# EAGLE design Nusbio1.0.WaveShare.I2C.LCD (EAGLE 9.6.2)
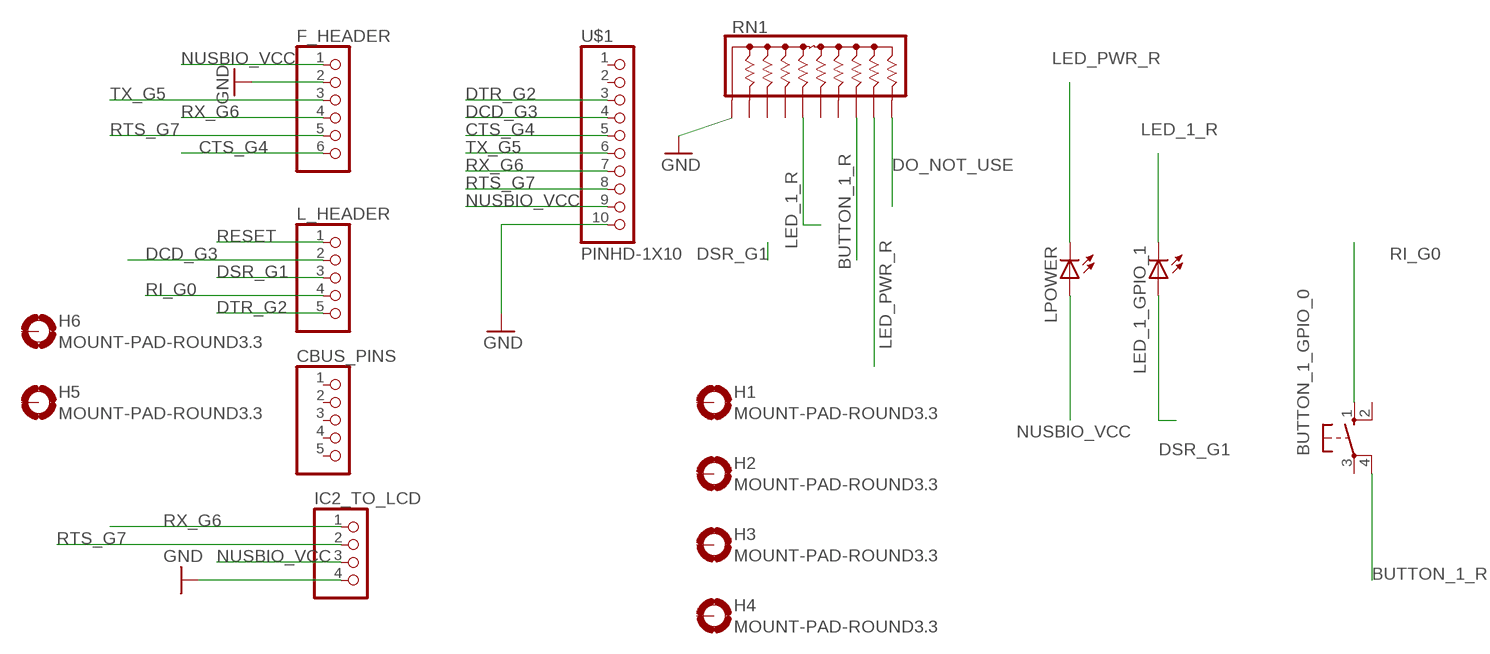
[diagram p0: schematic, sheet 1]

## Parts
BUTTON_1_GPIO_0  10-XX  [B3F-10XX]
CBUS_PINS  PINHD-1X5  [1X05]
F_HEADER  PINHD-1X6  [1X06]
H1  MOUNT-PAD-ROUND3.3  [3,3-PAD]
H2  MOUNT-PAD-ROUND3.3  [3,3-PAD]
H3  MOUNT-PAD-ROUND3.3  [3,3-PAD]
H4  MOUNT-PAD-ROUND3.3  [3,3-PAD]
H5  MOUNT-PAD-ROUND3.3  [3,3-PAD]
H6  MOUNT-PAD-ROUND3.3  [3,3-PAD]
IC2_TO_LCD  PINHD-1X4  [1X04]
L_HEADER  PINHD-1X5  [1X05]
LED_1_GPIO_1  LEDSMT1206  [1206]
LPOWER  LEDSMT1206  [1206]
RN1  4610X  [SIP10]
U$1  PINHD-1X10  [1X10-BIG]

## Nets
BUTTON_1_R: BUTTON_1_GPIO_0.4(P1) RN1.8
CTS_G4: F_HEADER.6 U$1.5
DCD_G3: L_HEADER.2 U$1.4
DO_NOT_USE: RN1.10
DSR_G1: L_HEADER.3 LED_1_GPIO_1.A
DTR_G2: L_HEADER.5 U$1.3
GND: F_HEADER.2 IC2_TO_LCD.4 RN1.1 U$1.10
LED_1_R: LED_1_GPIO_1.C RN1.5
LED_PWR_R: LPOWER.C RN1.9
NUSBIO_VCC: F_HEADER.1 IC2_TO_LCD.3 LPOWER.A U$1.9
RESET: L_HEADER.1
RI_G0: BUTTON_1_GPIO_0.1(S) L_HEADER.4
RTS_G7: F_HEADER.5 IC2_TO_LCD.2 U$1.8
RX_G6: F_HEADER.4 IC2_TO_LCD.1 U$1.7
TX_G5: F_HEADER.3 U$1.6
Unconnected: BUTTON_1_GPIO_0.2(S1) BUTTON_1_GPIO_0.3(P) CBUS_PINS.1 CBUS_PINS.2 CBUS_PINS.3 CBUS_PINS.4 CBUS_PINS.5 H1.B3,3(MOUNT) H2.B3,3(MOUNT) H3.B3,3(MOUNT) H4.B3,3(MOUNT) H5.B3,3(MOUNT) H6.B3,3(MOUNT) RN1.2 RN1.3 RN1.4 RN1.6 RN1.7 U$1.1 U$1.2

## Library data of the parts
BUTTON_1_GPIO_0 = switch-omron:10-XX: OMRON SWITCH; MPN: B3F-1000; OC_FARNELL: 176432; OC_NEWARK: 36M3542
CBUS_PINS L_HEADER = pinhead:PINHD-1X5: PIN HEADER
F_HEADER = adafruit:PINHD-1X6: PIN HEADER
H1-H6 = holes:MOUNT-PAD-ROUND: MOUNTING PAD, round
IC2_TO_LCD = pinhead:PINHD-1X4: PIN HEADER
LED_1_GPIO_1 LPOWER = adafruit:LED: LED OSRAM: - CHIPLED LG R971, LG N971, LY N971, LG Q971, LY Q971, LO R971, LY R971 LH N974, LH R974 LS Q976, LO Q976, LY Q976 LO Q996 - Hyper CHIPLED LW Q18S LB Q993, LB Q99A, LB R99A - SideLED LS A670, LO A670, LY A670, LG A670, LP A670 LB A673, LV A673, LT A673, LW A673 LH A674 LY A675 LS A676, LA A676, LO A676, LY A676, LW A676 LS A679, LY A679, LG A679 - Hyper Micro SIDELED® LS Y876, LA Y876, LO Y876, LY Y876 LT Y87S - SmartLED LW L88C, LW L88S LB L89C, LB L89S, LG L890 LS L89K, LO L89K, LY L89K LS L896, LA L896, LO L896, LY L896 - TOPLED LS T670, LO T670, LY T670, LG T670, LP T670 LSG T670, LSP T670, LSY T670, LOP T670, LYG T670 LG T671, LOG T671, LSG T671 LB T673, LV T673, LT T673, LW T673 LH T674 LS T676, LA T676, LO T676, LY T676, LB T676, LH T676, LSB T676, LW T676 LB T67C, LV T67C, LT T67C, LS T67K, LO T67K, LY T67K, LW E67C LS E67B, LA E67B, LO E67B, LY E67B, LB E67C, LV E67C, LT E67C LW T67C LS T679, LY T679, LG T679 LS T770, LO T770, LY T770, LG T770, LP T770 LB T773, LV T773, LT T773, LW T773 LH T774 LS E675, LA E675, LY E675, LS T675 LS T776, LA T776, LO T776, LY T776, LB T776 LHGB T686 LT T68C, LB T68C - Hyper Mini TOPLED® LB M676 - Mini TOPLED Santana® LG M470 LS M47K, LO M47K, LY M47K Source: http://www.osram.convergy.de/
RN1 = resistor-sip:4610X: Bourns 4600X Series - Thick Film Conformal SIPs 4610X-101 Resistor Network Configuration: 101 (Bussed Resistors) Resistance range: 10 ohms to 10 Megaohms Maximum Operating Voltage: 100V Source: http://www.bourns.com/ProductLine.aspx?name=standard_thick_film_networks PDF: http://www.bourns.com/data/global/pdfs/4600X.pdf
U$1 = adafruit:PINHD-1X10: Pin header 1x10 0.1" spacing With round pins

## Board
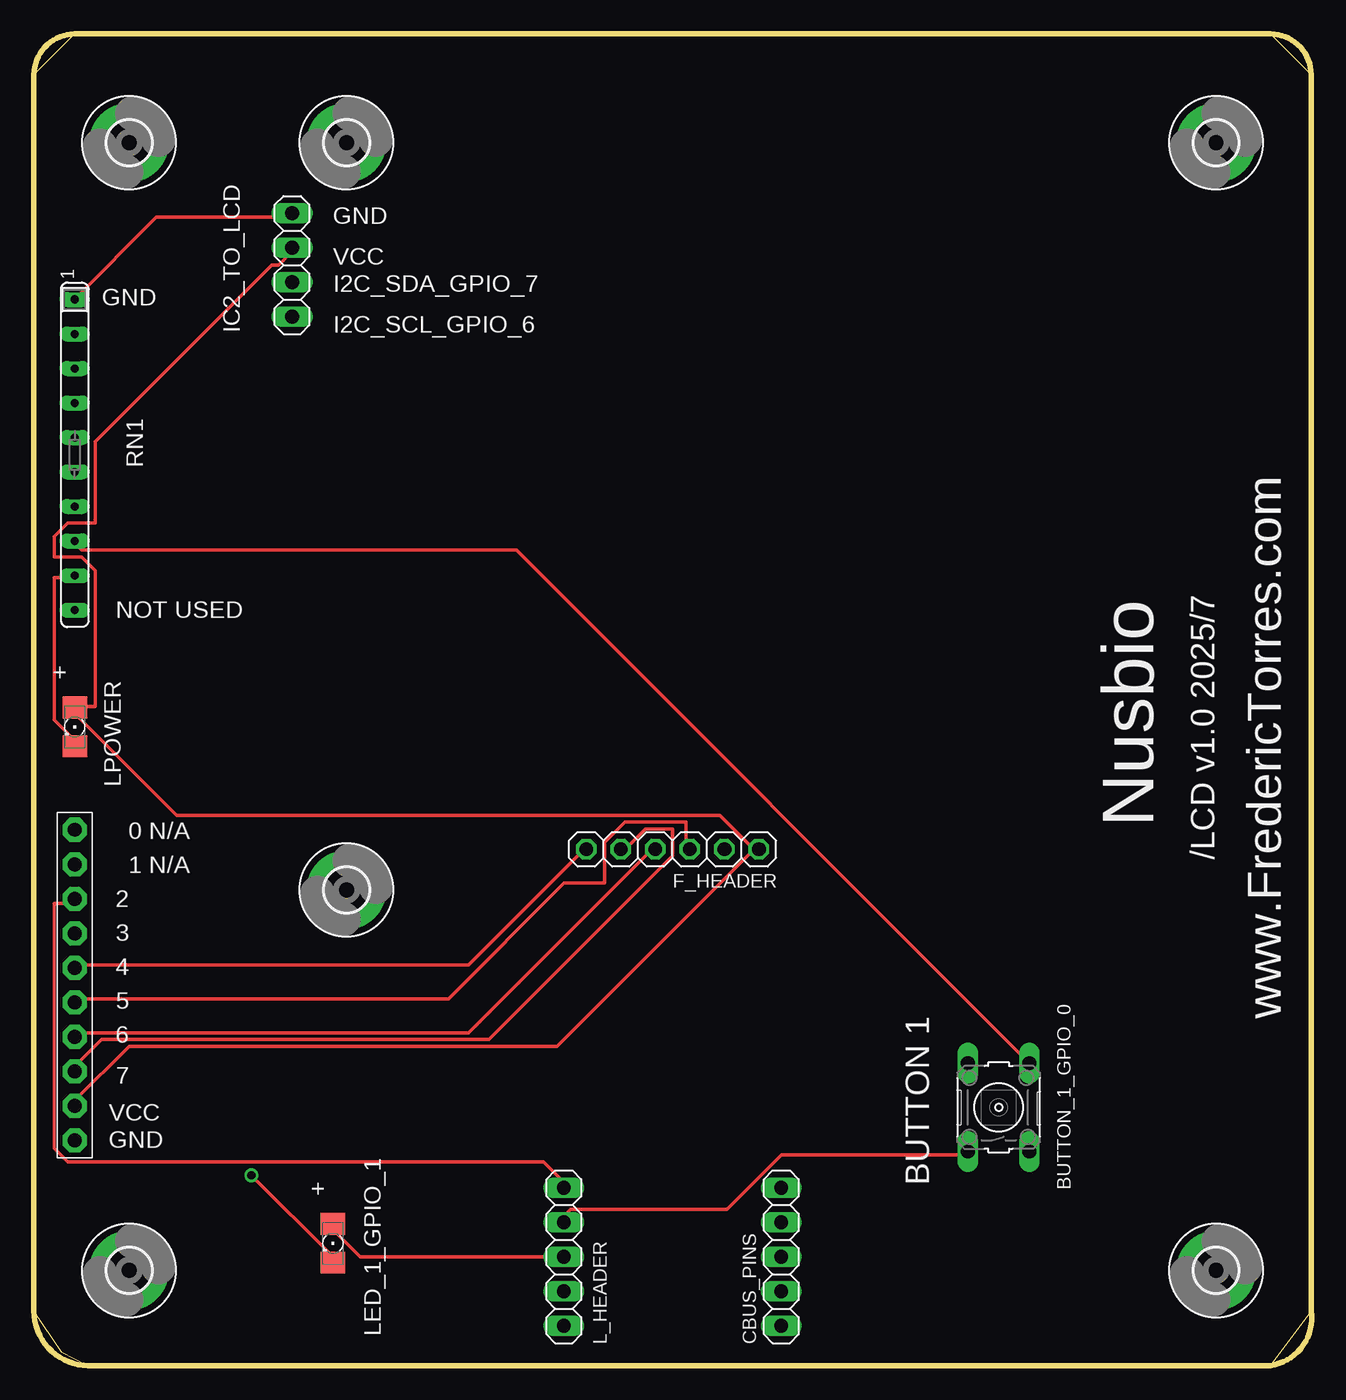
[diagram p1: board, top side]
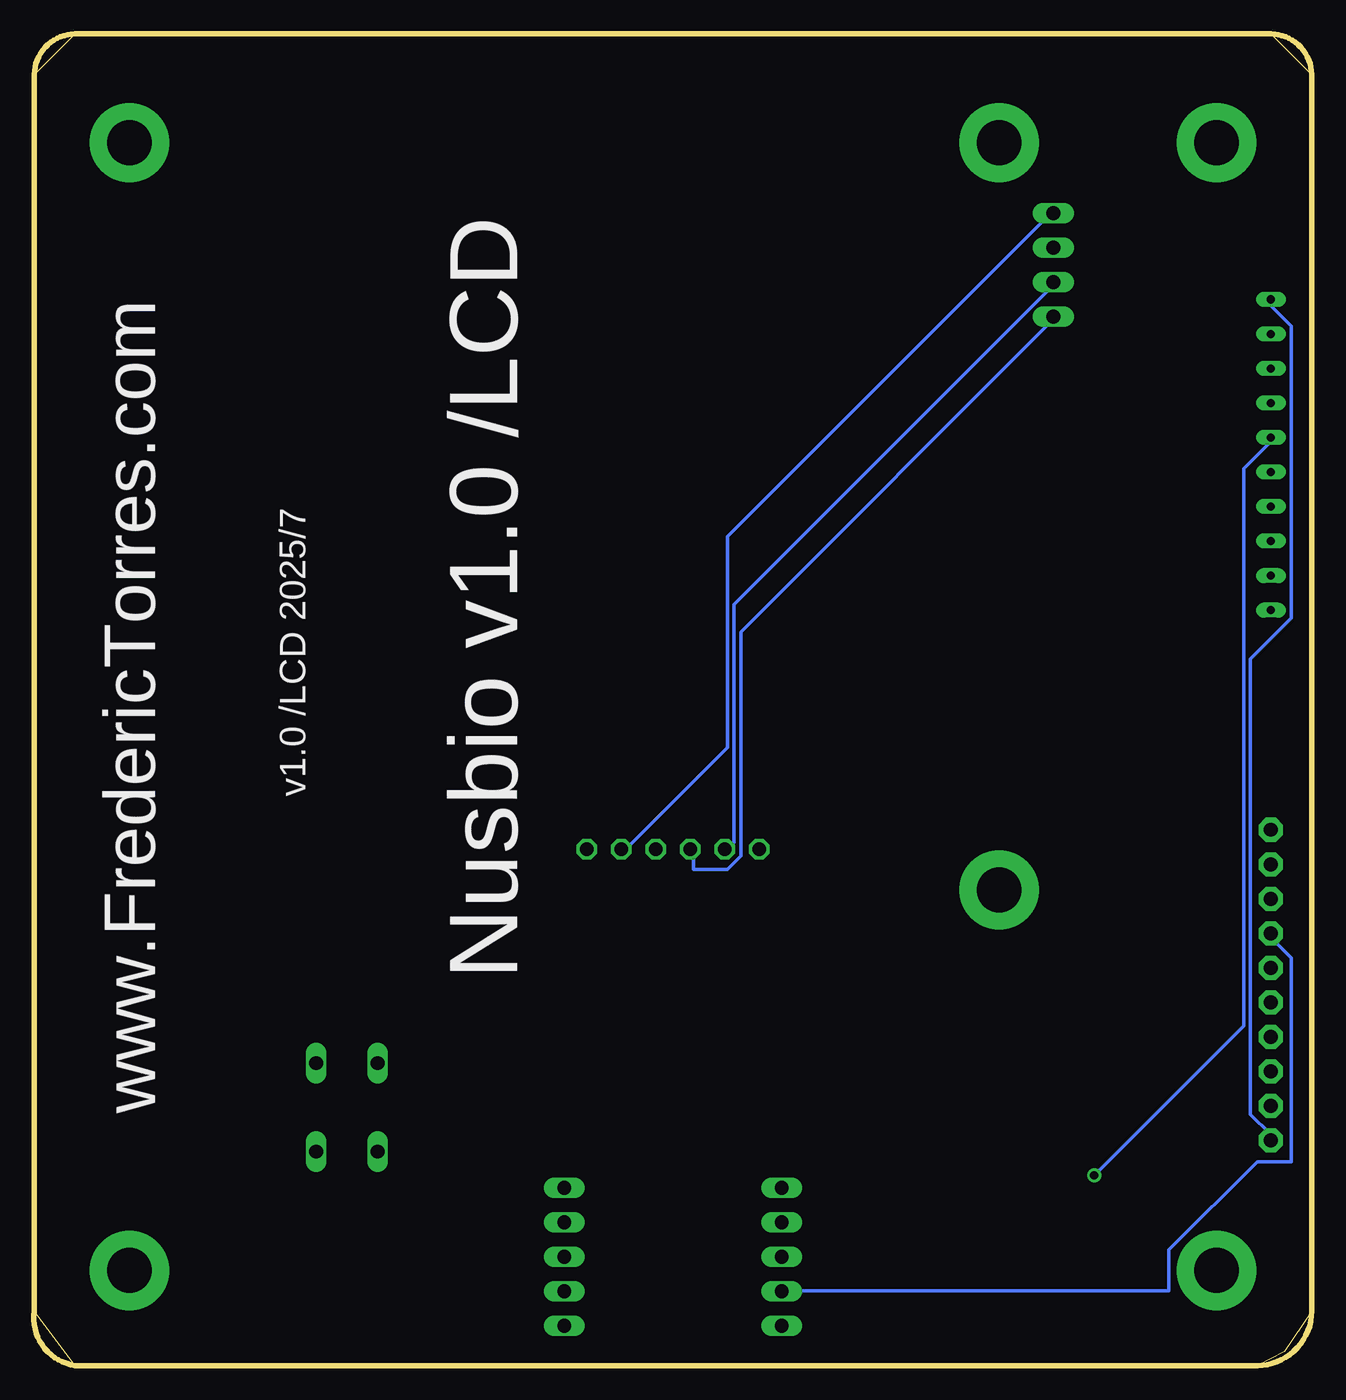
[diagram p2: board, bottom side, seen from below]

Size 94.03 x 98 mm. Coordinates in mm from the lower left corner, seen from the top.
Outline: 4,0 2,1 0,4
Outline: 91,0 94,4
Outline: 94,95 91,98
Outline: 3,98 0,95
Outline: 0,95 arc-90 3,98
Outline: 3,98 91,98
Outline: 91,98 arc-90 94,95
Outline: 94,95 94,4
Outline: 94,4 arc-90 91,0
Outline: 91,0 4,0
Outline: 4,0 arc-90 0,4
Outline: 0,4 0,95
Copper layers (1*16): Top 0.035mm / dielectric 1.5mm / Bottom 0.035mm
Design rules "default": minimum track width 10mil, minimum drill 24mil, track to track 8mil, track to pad 8mil, pad to pad 8mil, via to via 8mil, smd to smd 8mil, copper to edge 40mil, drill to drill 8mil, minimum pad ring 10mil, minimum via ring 8mil, stop-mask expansion 4mil, vias tented up to drill 0mil, thermal gap 10mil

### Footprints (pad centres in the part's own frame; a part is rotated, then mirrored left to right if it is on the bottom)
B3F-10XX = drill 1.016 long: 1 -3.251,2.261; 2 3.251,2.261; 3 -3.251,-2.261; 4 3.251,-2.261
1X05 = drill 1.016 long: 1 -5.08,0; 2 -2.54,0; 3 0,0; 4 2.54,0; 5 5.08,0
1X06 = drill 1.016 octagon: 1 -6.35,0; 2 -3.81,0; 3 -1.27,0; 4 1.27,0; 5 3.81,0; 6 6.35,0
3,3-PAD = drill 3.3 pad 5.842: B3,3 0,0
1X04 = drill 1.016 long: 1 -3.81,0; 2 -1.27,0; 3 1.27,0; 4 3.81,0
1206 = smd 1.6 x 1.803: A -1.422,0; C 1.422,0
SIP10 = drill 0.6 long: 1 -11.46,0; 2 -8.92,0; 3 -6.38,0; 4 -3.84,0; 5 -1.3,0; 6 1.24,0; 7 3.78,0; 8 6.32,0; 9 8.86,0; 10 11.4,0
1X10-BIG = drill 1.016 pad 1.778 octagon: 1 -11.43,0; 2 -8.89,0; 3 -6.35,0; 4 -3.81,0; 5 -1.27,0; 6 1.27,0; 7 3.81,0; 8 6.35,0; 9 8.89,0; 10 11.43,0

### Placement (x,y rotation side)
BUTTON_1_GPIO_0  71,19 90 top
CBUS_PINS  55,8 90 top
F_HEADER  47,38 180 top
H1  7,7 0 top
H2  87,7 0 top
H3  7,90 0 top
H4  87,90 0 top
H5  23,35 0 top
H6  23,90 0 top
IC2_TO_LCD  19,81 90 top
L_HEADER  39,8 90 top
LED_1_GPIO_1  22,9 270 top
LPOWER  3,47 270 top
RN1  3,67 270 top
U$1  3,28 270 top

### Tracks (layer width: path | path; a pad name or v marks a point on that pad's centre or on a via)
BUTTON_1_R
  Top 0.254: RN1.8 3,60.5 3.5,60 35.5,60 73,22.5 BUTTON_1_GPIO_0.4
CTS_G4
  Top 0.254: F_HEADER.6 40.5,38 32,29.5 3,29.5 U$1.5
DCD_G3
  Bottom 0.254: L_HEADER.2 39,5.5 10.5,5.5 10.5,8.5 4,15 1.5,15 1.5,30 3,31.5 U$1.4
DSR_G1
  Top 0.254: L_HEADER.3 24,8 22,10 LED_1_GPIO_1.A
DTR_G2
  Top 0.254: L_HEADER.5 39,13.5 37.5,15 2.5,15 1.5,16 1.5,34 3,34 U$1.3
GND
  Top 0.254: RN1.1 3,78.5 9,84.5 19,84.5 IC2_TO_LCD.4
  Bottom 0.254: F_HEADER.2 50.5,38 43,45.5 43,61 19,85 IC2_TO_LCD.4 | U$1.10 3,17 4.5,18.5 4.5,52 1.5,55 1.5,76.5 3,78 RN1.1
LED_1_R  (via drill 0.61)
  Top 0.254: v16,14 22,8 LED_1_GPIO_1.C
  Bottom 0.254: v16,14 5,25 5,66 3,68 RN1.5
LED_PWR_R
  Top 0.254: LPOWER.C 3,46 1.5,47.5 1.5,58 3,58 RN1.9
NUSBIO_VCC
  Top 0.254: 53,38 50.5,40.5 10.5,40.5 3,48 LPOWER.A 3,48.5 4.5,48.5 4.5,58.5 3.5,59.5 1.5,59.5 1.5,61 2.5,62 4.5,62 4.5,68 17.5,81 18,81 19,82 IC2_TO_LCD.3 | 53,38 38.5,23.5 7,23.5 3,19.5 U$1.9 | 53,38 F_HEADER.1
RI_G0
  Top 0.254: L_HEADER.4 39,11 39.5,11.5 51,11.5 55,15.5 68.5,15.5 BUTTON_1_GPIO_0.1
RTS_G7
  Top 0.254: U$1.8 3,22 5,24 33.5,24 47,37.5 47,39.5 45,39.5 43.5,38 F_HEADER.5
  Bottom 0.254: F_HEADER.5 43,38 42.5,38.5 42.5,56 19,79.5 IC2_TO_LCD.2
RX_G6
  Top 0.254: F_HEADER.4 45.5,38 32,24.5 3,24.5 U$1.7
  Bottom 0.254: IC2_TO_LCD.1 19,77 42,54 42,37.5 43,36.5 45.5,36.5 45.5,38 F_HEADER.4
TX_G5
  Top 0.254: F_HEADER.3 48,38 48,40 43.5,40 42,38.5 42,35.5 39,35.5 30.5,27 3,27 U$1.6

### Text on the board
tNames: GND | VCC | I2C_SDA_GPIO_7 | GND | I2C_SCL_GPIO_6 | NOT USED | + | Nusbio | /LCD v1.0 2025/7 | www.FredericTorres.com | 0 N/A | 1 N/A | 2 | 3 | 4 | 5 | 6 | 7 | BUTTON 1 | VCC | GND | +
bNames: Nusbio v1.0 /LCD | v1.0 /LCD 2025/7 | www.FredericTorres.com